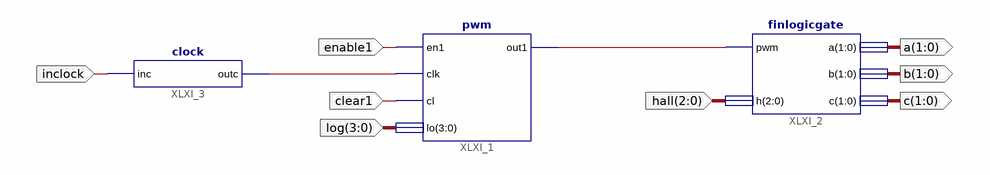
[diagram p0: schematic sheet 1]
// Xilinx ISE schematic motordriver4.sch (artix7) as structural Verilog: 3 symbols, 8 ports
module motordriver4 (
  input  inclock,
  input  clear1,
  input  [3:0] log,
  input  [2:0] hall,
  input  enable1,
  output [1:0] c,
  output [1:0] b,
  output [1:0] a
);

  wire XLXN_2, XLXN_4;

  pwm XLXI_1 (.en1(enable1), .clk(XLXN_4), .cl(clear1), .lo(log), .out1(XLXN_2));
  finlogicgate XLXI_2 (.pwm(XLXN_2), .h(hall), .a(a), .b(b), .c(c));
  clock XLXI_3 (.inc(inclock), .outc(XLXN_4));
endmodule
